# Altium project a3-基于STM32的DDS信号源的设计实例.PrjPcb
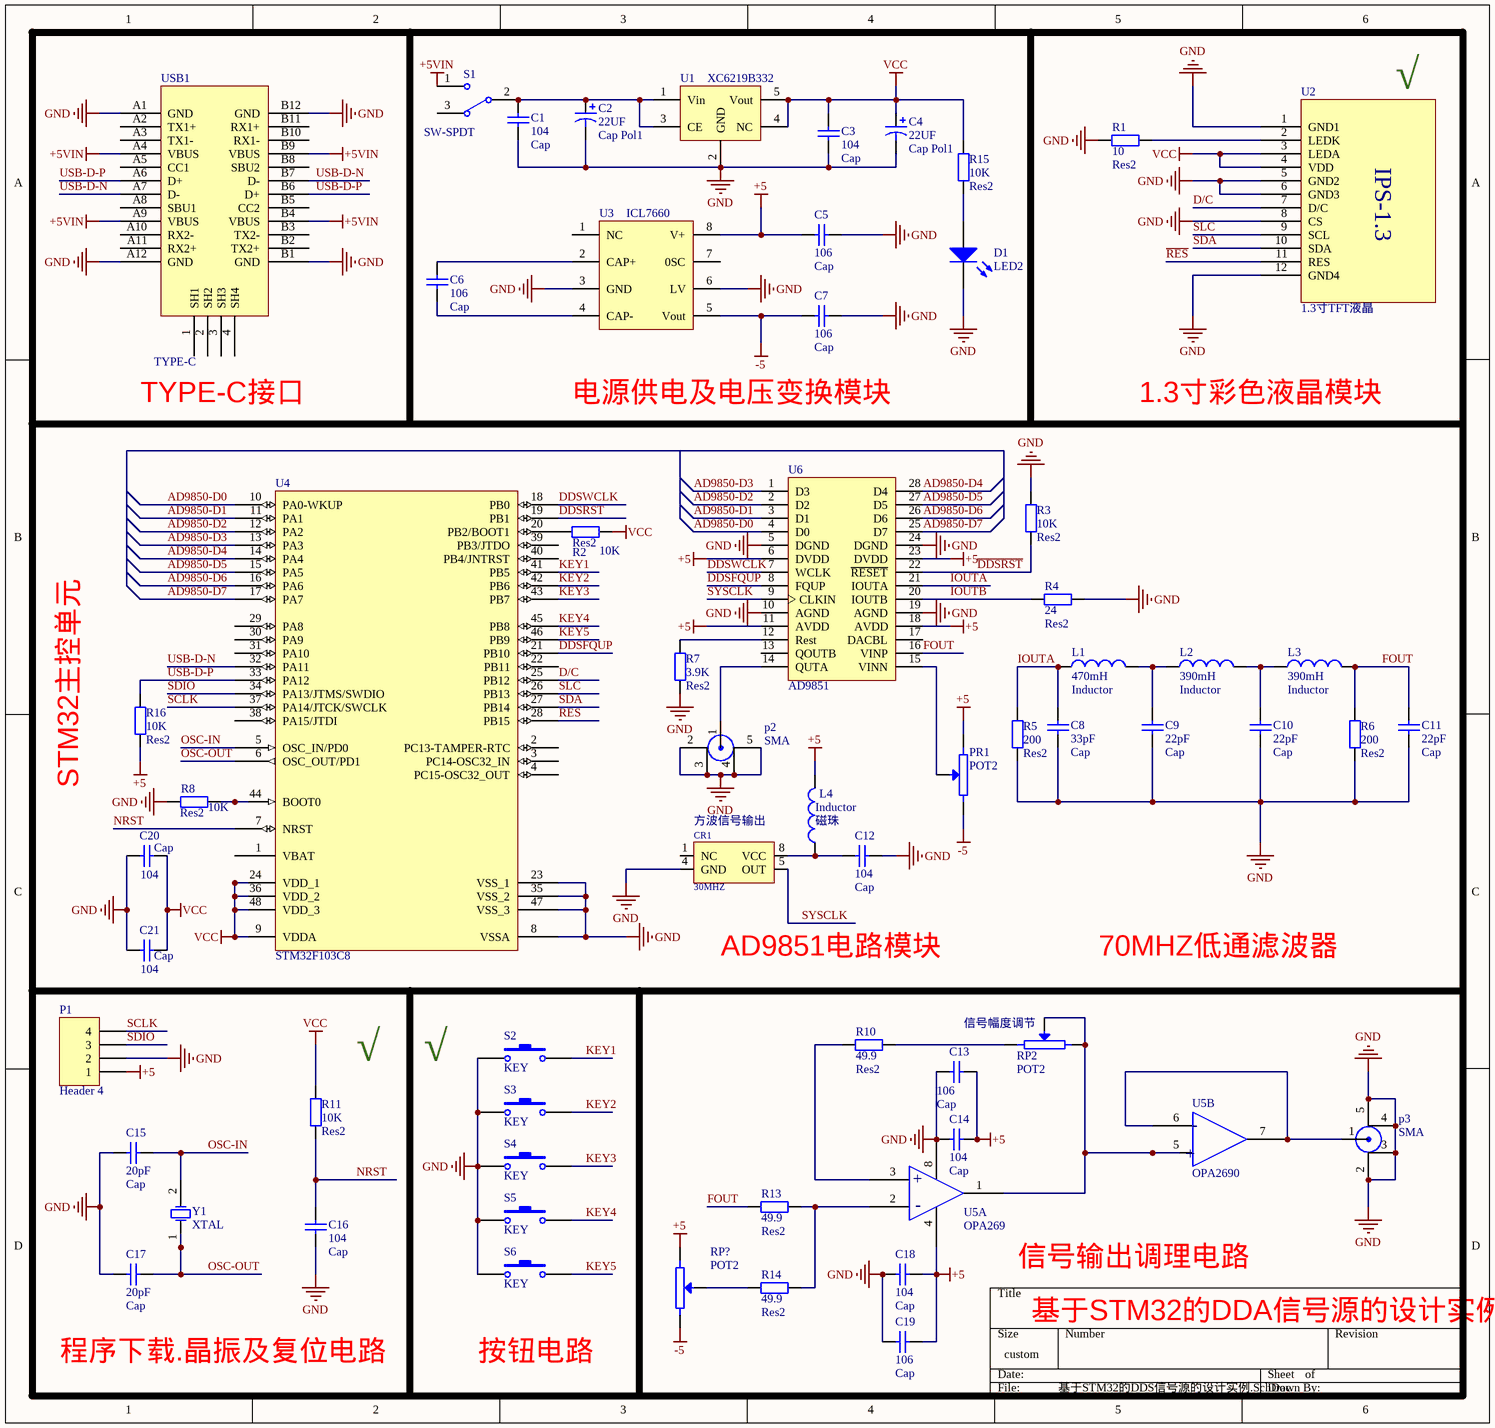
[diagram p0: 基于STM32的DDS信号源的设计实例.SchDoc]
1 sheet, 61 parts. Net scope: global (net labels, ports and power ports of the same name join across sheets).
Board file: 基于STM32的DDS信号源的设计实例.PcbDoc

## Sheet 基于STM32的DDS信号源的设计实例.SchDoc
size 279 x 266 mm; SheetNumber: 1; SheetTotal: 1; SPICEModelCacheRBZRPSTF: <root> / <DocumentId>RBZRPSTF</DocumentId> / </root>

### Parts
C1  Cap  value 104  [C0805]
C2  Cap Pol1  value 22UF  [C1210_N]
C3  Cap  value 104  [C0805]
C4  Cap Pol1  value 22UF  [C1210_N]
C5  Cap  value 106  [C0805]
C6  Cap  value 106  [C0805]
C7  Cap  value 106  [C0805]
C8  Cap  value 33pF  [C0805]
C9  Cap  value 22pF  [C0805]
C10  Cap  value 22pF  [C0805]
C11  Cap  value 22pF  [C0805]
C12  Cap  value 104  [C0805]
C13  Cap  value 106  [C0805]
C14  Cap  value 104  [C0805]
C15  Cap  value 20pF  [C0805]
C16  Cap  value 104  [C0805]
C17  Cap  value 20pF  [C0805]
C18  Cap  value 104  [C0805]
C19  Cap  value 106  [C0805]
C20  Cap  value 104  [C0805]
C21  Cap  value 104  [C0805]
CR1  30MHZ  [CRYSTAL-SMT-5X7]
D1  LED2  [D0805+]
L1  Inductor  value 470mH  [0402-A]
L2  Inductor  value 390mH  [0402-A]
L3  Inductor  value 390mH  [0402-A]
L4  Inductor  [0402-A]
P1  Header 4  [HDR1X4]
p2  SMA  [SMA-KE]
p3  SMA  [SMA-KE]
PR1  POT2  [VR7]
R1  Res2  value 10  [C0805]
R2  Res2  value 10K  [C0805]
R3  Res2  value 10K  [C0805]
R4  Res2  value 24  [C0805]
R5  Res2  value 200  [C0805]
R6  Res2  value 200  [C0805]
R7  Res2  value 3.9K  [C0805]
R8  Res2  value 10K  [C0805]
R10  Res2  value 49.9  [C0805]
R11  Res2  value 10K  [C0805]
R13  Res2  value 49.9  [C0805]
R14  Res2  value 49.9  [C0805]
R15  Res2  value 10K  [C0805]
R16  Res2  value 10K  [C0805]
RP2  POT2  [VR7]
RP?  POT2  [VR7]
S1  SW-SPDT  [SW-SPDT-7P]
S2  KEY  [SW-MINI]
S3  KEY  [SW-MINI]
S4  KEY  [SW-MINI]
S5  KEY  [SW-MINI]
S6  KEY  [SW-MINI]
U1  XC6219B332  [SOT23-5L]
U2  1.3寸TFT液晶  [1.3-TFT-TPS]
U3  ICL7660  [SO8_N]
U4  STM32F103C8  [TQFP-48]
U5  OPA269  [SO-8]  (parts A,B of 2)
U6  AD9851  [TSSOP28]
USB1  TYPE-C  [TYPE-C]
Y1  XTAL  [XTAL2]

### Nets
+5: C5.1 C13.2 C14.2 C18.2 C19.2 L4.2 P1.1 PR1.2 R16.2 RP?.1 U3.8(V+) U5.4 U6.6(DVDD) U6.11(AVDD) U6.18(AVDD) U6.23(DVDD)
+5VIN: S1.1 USB1.A4(VBUS) USB1.A9(VBUS) USB1.B4(VBUS) USB1.B9(VBUS)
-5: C7.1 PR1.1 RP?.2 U3.5(Vout)
GND: C1.2 C2.2 C3.2 C4.2 C5.2 C7.2 C8.1 C9.1 C10.1 C11.1 C12.1 C13.1 C14.1 C15.1 C16.1 C17.2 C18.1 C19.1 C20.1 C21.1 CR1.4(GND) D1.K P1.2 p2.2 p2.3 p2.4 p2.5 p3.2 p3.3 p3.4 p3.5 R1.1 R3.2 R4.1 R5.1 R6.1 R7.2 R8.2 S2.1 S3.1 S4.1 S5.1 S6.1 U1.2(GND) U2.1(GND1) U2.5(GND2) U2.6(GND3) U2.8(CS) U2.12(GND4) U3.3(GND) U3.6(LV) U4.8(VSSA) U4.23(VSS_1) U4.35(VSS_2) U4.47(VSS_3) U5.8 U6.5(DGND) U6.10(AGND) U6.19(AGND) U6.24(DGND) USB1.A1(GND) USB1.A12(GND) USB1.B1(GND) USB1.B12(GND)
VCC: C3.1 C4.1 C20.2 C21.2 R2.1 R11.2 R15.2 U1.4(NC) U1.5(Vout) U2.3(LEDA) U2.4(VDD) U4.9(VDDA) U4.24(VDD_1) U4.36(VDD_2) U4.48(VDD_3)
AD9850-D0: U4.10(PA0-WKUP) U6.4(D0)
AD9850-D1: U4.11(PA1) U6.3(D1)
AD9850-D2: U4.12(PA2) U6.2(D2)
AD9850-D3: U4.13(PA3) U6.1(D3)
AD9850-D4: U4.14(PA4) U6.28(D4)
AD9850-D5: U4.15(PA5) U6.27(D5)
AD9850-D6: U4.16(PA6) U6.26(D6)
AD9850-D7: U4.17(PA7) U6.25(D7)
D/C: U2.7(D/C) U4.25(PB12)
~{DDSRST}: R3.1 U4.19(PB1) U6.22(~{RESET})
DDSFQUP: U4.21(PB10) U6.8(FQUP)
DDSWCLK: U4.18(PB0) U6.7(WCLK)
FOUT: C11.2 L3.2 R6.2 R13.2 U6.16(VINP)
IOUTA: C8.2 L1.1 R5.2 U6.21(IOUTA)
IOUTB: R4.2 U6.20(IOUTB)
KEY1: S2.2 U4.41(PB5)
KEY2: S3.2 U4.42(PB6)
KEY3: S4.2 U4.43(PB7)
KEY4: S5.2 U4.45(PB8)
KEY5: S6.2 U4.46(PB9)
NRST: C16.2 R11.1 U4.7(NRST)
OSC-IN: C15.2 U4.5(OSC_IN/PD0) Y1.2(OSC2)
OSC-OUT: C17.1 U4.6(OSC_OUT/PD1) Y1.1(OSC1)
~{RES}: U2.11(RES) U4.28(PB15)
SCLK: P1.4 U4.37(PA14/JTCK/SWCLK)
SDA: U2.10(SDA) U4.27(PB14)
SDIO: P1.3 U4.34(PA13/JTMS/SWDIO)
SLC: U2.9(SCL) U4.26(PB13)
SYSCLK: CR1.5(OUT) U6.9(CLKIN)
USB-D-N: U4.32(PA11) USB1.A7(D-) USB1.B7(D-)
USB-D-P: R16.1 U4.33(PA12) USB1.A6(D+) USB1.B6(D+)
NetC1_1: C1.1 C2.1 S1.2 U1.1(Vin) U1.3(CE)
NetC6_1: C6.1 U3.2(CAP+)
NetC6_2: C6.2 U3.4(CAP-)
NetC9_2: C9.2 L1.2 L2.1
NetC10_2: C10.2 L2.2 L3.1
NetC12_2: C12.2 CR1.8(VCC) L4.1
NetD1_A: D1.A R15.1
Netp2_1: p2.1 U6.14(QUTA)
Netp3_1: p3.1 U5.6 U5.7
NetPR1_3: PR1.3 U6.15(VINN)
NetR1_2: R1.2 U2.2(LEDK)
NetR2_2: R2.2 U4.20(PB2/BOOT1)
NetR7_1: R7.1 U6.12(Rest)
NetR8_1: R8.1 U4.44(BOOT0)
NetR10_1: R10.1 RP2.1
NetR10_2: R10.2 U5.3
NetR13_1: R13.1 R14.1 U5.2
NetR14_2: R14.2 RP?.3
NetRP2_2: RP2.2 RP2.3 U5.1 U5.5

Not connected (* = marked no-connect by the designer): CR1 1(NC); S1 3; U3 1(NC) 7(0SC); U4 1(VBAT) 2(PC13-TAMPER-RTC) 3(PC14-OSC32_IN) 4(PC15-OSC32_OUT) 22(PB11) 29(PA8) 30(PA9) 31(PA10) 38(PA15/JTDI) 39(PB3/JTDO) 40(PB4/JNTRST); U6 13(QOUTB) 17(DACBL); USB1 1(SH1) 2(SH2) 3(SH3) 4(SH4) A2(TX1+) A3(TX1-) A5(CC1) A8(SBU1) A10(RX2-) A11(RX2+) B2(TX2+) B3(TX2-) B5(CC2) B8(SBU2) B10(RX1-) B11(RX1+)

### Notes on the sheet
- √
- TYPE-C接口
- 电源供电及电压变换模块
- 1.3寸彩色液晶模块
- STM32主控单元
- (near CR1) 方波信号输出
- (near L4) 磁珠
- AD9851电路模块
- 70MHZ低通滤波器
- (near RP2) 信号幅度调节
- (near R11) √
- 信号输出调理电路
- 程序下载.晶振及复位电路
- 按钮电路
- 基于STM32的DDA信号源的设计实例
- (in symbol 1.3寸TFT液晶) IPS-1.3
- (in symbol OPA269, part A) +; -
- (in symbol OPA269, part B) -; +

### Library data of the parts
C1 C3 C5-C21 = Cap: Capacitor; Published: 8-Jun-2000; LatestRevisionDate: 17-Jul-2002; LatestRevisionNote: Re-released for DXP Platform.; PackageReference: RAD-0.3; Publisher: Altium Limited; PackageDescription: Radial Cap, Thru-Hole; 2 Leads; 0.3 in Pin Spacing
C2 C4 = Cap Pol1: Polarized Capacitor (Radial); Published: 8-Jun-2000; LatestRevisionDate: 17-Jul-2002; LatestRevisionNote: Re-released for DXP Platform.; PackageReference: RB7.6-15; Publisher: Altium Limited; PackageDescription: Polarized Capacitor (Radial); 2 Leads
CR1 = CRYSTAL-DIP8
D1 = LED2: Typical RED, GREEN, YELLOW, AMBER GaAs LED; Published: 8-Jun-2000; LatestRevisionDate: 17-Jul-2002; LatestRevisionNote: Re-released for DXP Platform.; PackageVersion: Feb-2002; PackageReference: 3.2X1.6X1.1; Publisher: Altium Limited; PackageDescription: SM LED; 2 Flat Leads
L1-L4 = Inductor: Code_IEC: 1005; Published: 8-Jun-2000; LatestRevisionDate: 29-May-2009; LatestRevisionNote: IPC-7351 Footprint Added.; PackageReference: 0402-A; Publisher: Altium Limited; PackageDescription: Chip Inductor; Code_JEITA: 0402
P1 = Header 4: Header, 4-Pin; LatestRevisionDate: 17-Jul-2002; LatestRevisionNote: Re-released for DXP Platform.; Publisher: Altium Limited
PR1 RP2 RP? = POT2: Potentiometer
R1-R8 R10 R11 R13-R16 = Res2: Resistor; Published: 8-Jun-2000; LatestRevisionDate: 17-Jul-2002; LatestRevisionNote: Re-released for DXP Platform.; PackageReference: AXIAL-0.4; Publisher: Altium Limited; PackageDescription: Axial Device, Thru-Hole; 2 Leads; 0.4 in Pin Spacing
S1 = SW-SPDT: SPDT Subminiature Toggle Switch, Right Angle Mounting, Vertical Actuation; Published: 24-Mar-1999; LatestRevisionDate: 17-Dec-2003; LatestRevisionNote: Schematic revised, PCB Footprint replaced.; DatasheetVersion: 05-Dec-2000; PackageReference: TL36WW15050; Publisher: Altium Limited; PackageDescription: Switch; 4 Leads; ComponentLink1Description: Manufacturer Link; ComponentLink1URL: http://www.apem.com
S2-S6 = SW-PB: Switch; Published: 24-Mar-1999; LatestRevisionDate: 17-Jul-2002; LatestRevisionNote: Re-released for DXP Platform.; PackageReference: SPST-2; Publisher: Altium Limited; PackageDescription: Switch; 2 Leads
U1 = XC6219
U4 = STM32F103C8: Flaah:64/RAM:20/IO:36; BOM名称: 32位STM单片机; 版权归属: 源创客; 学习资源: www.ooocke.com
Y1 = XTAL: Crystal Oscillator; Published: 8-Jun-2000; LatestRevisionDate: 17-Jul-2002; LatestRevisionNote: Re-released for DXP Platform.; PackageReference: R38; Publisher: Altium Limited; PackageDescription: Crystal, Thru-Hole; 2 Leads; Body 3.1 x 8.2 mm (Dia.xH)